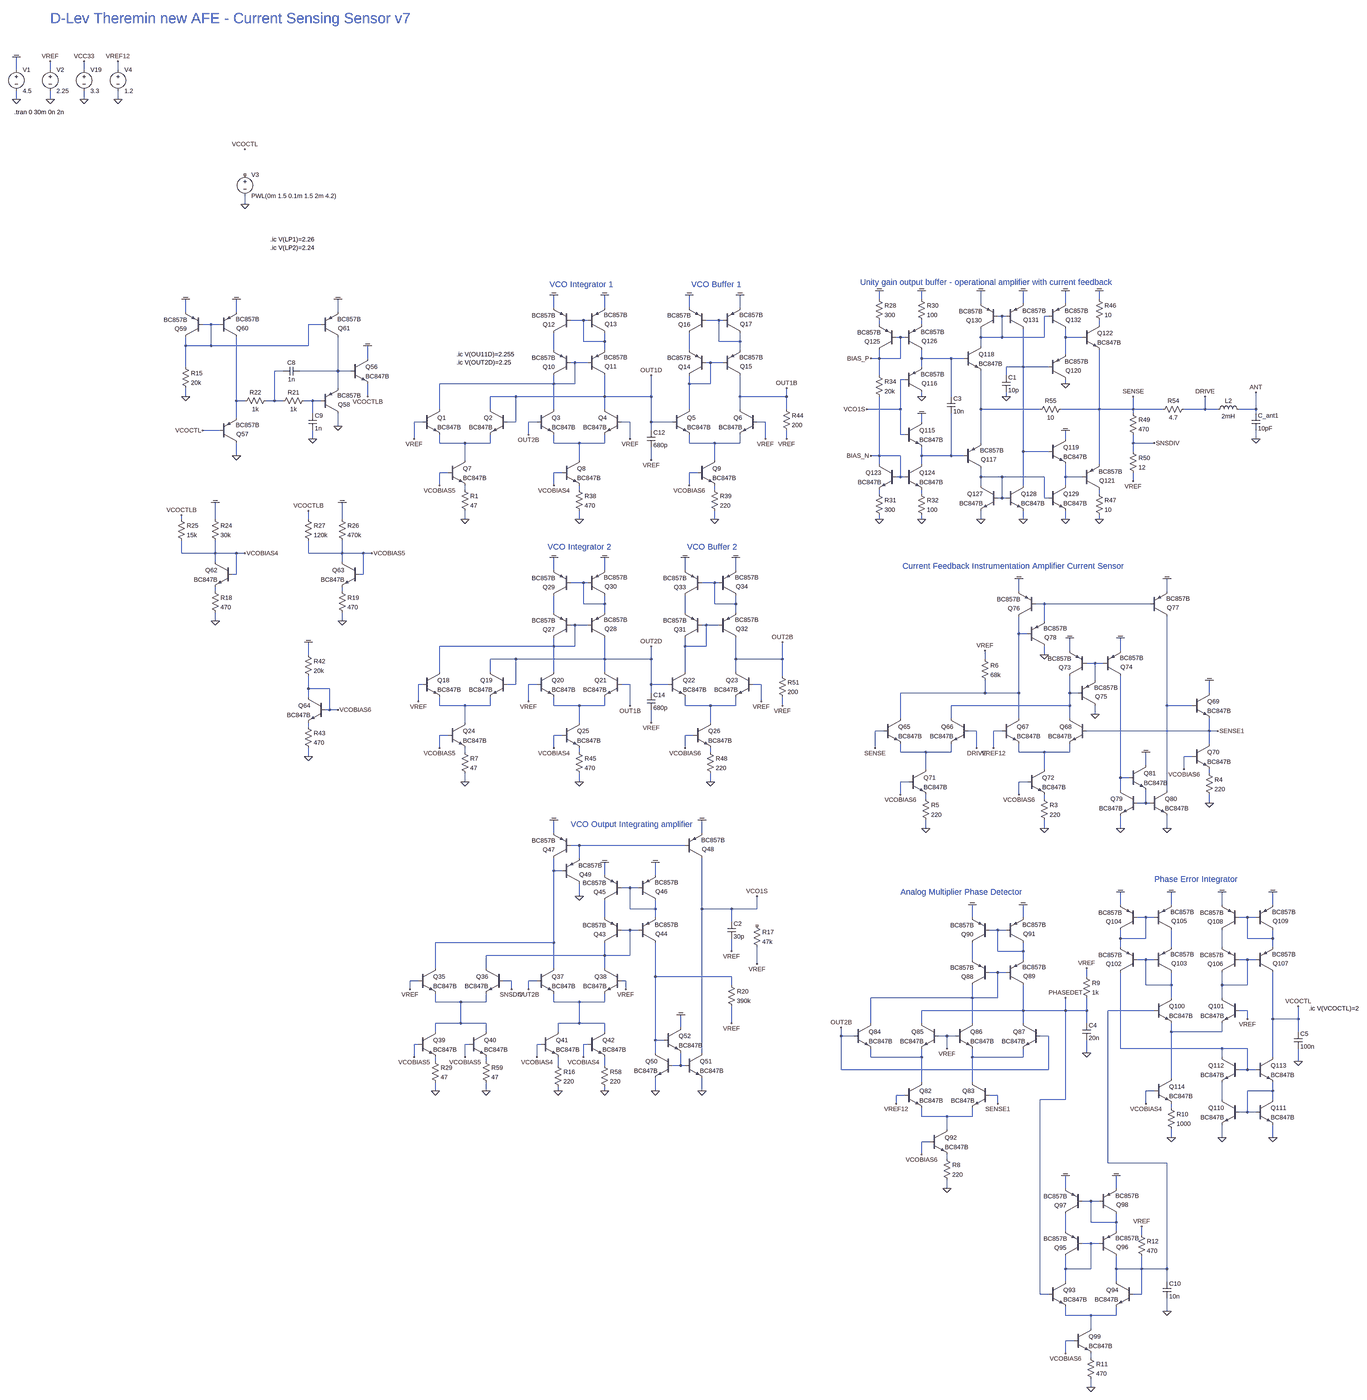
[diagram p0: schematic dlev_frontend_curr_sens_v15.asc, whole sheet]
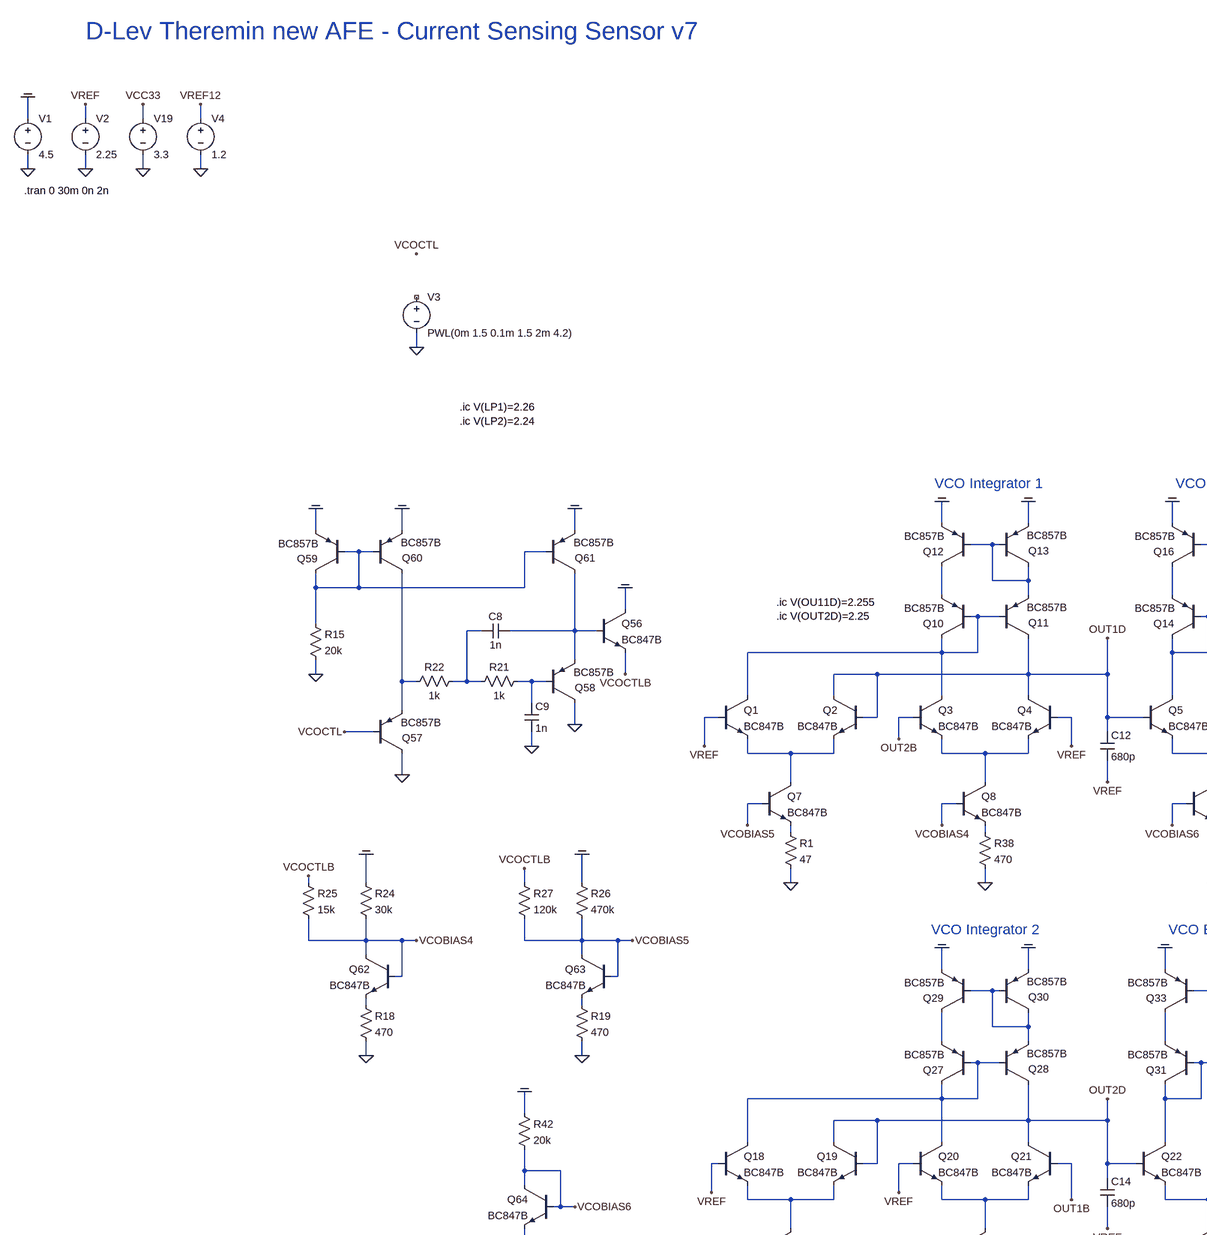
[diagram p1: schematic dlev_frontend_curr_sens_v15.asc, part, row 1 of 2, column 1 of 2]
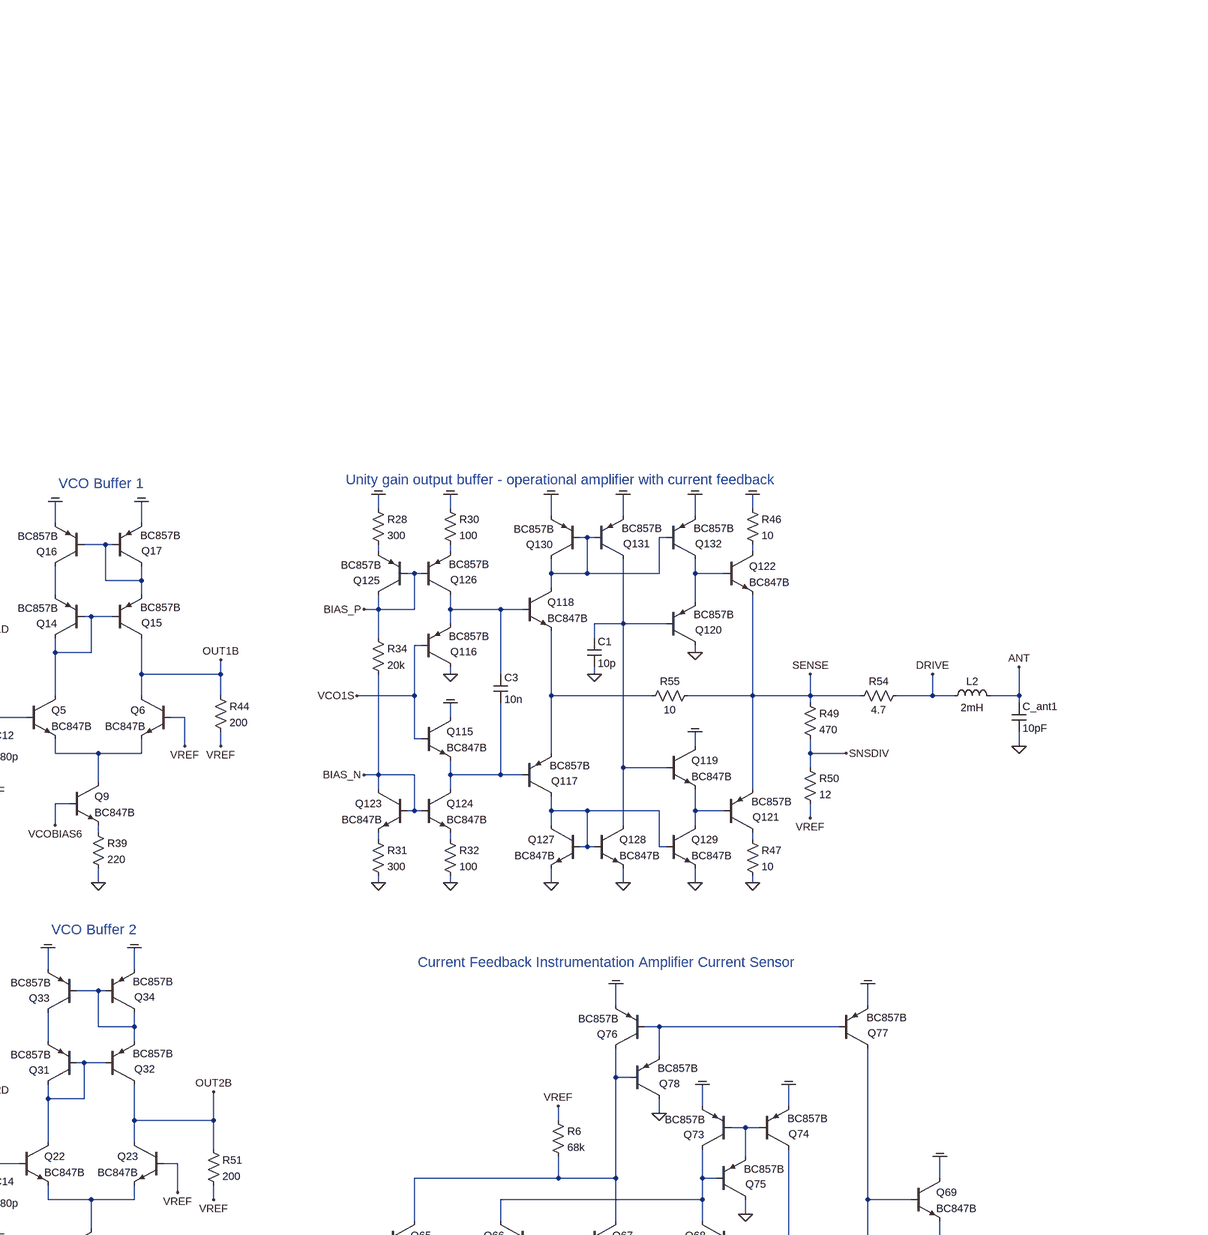
[diagram p2: schematic dlev_frontend_curr_sens_v15.asc, part, row 1 of 2, column 2 of 2]
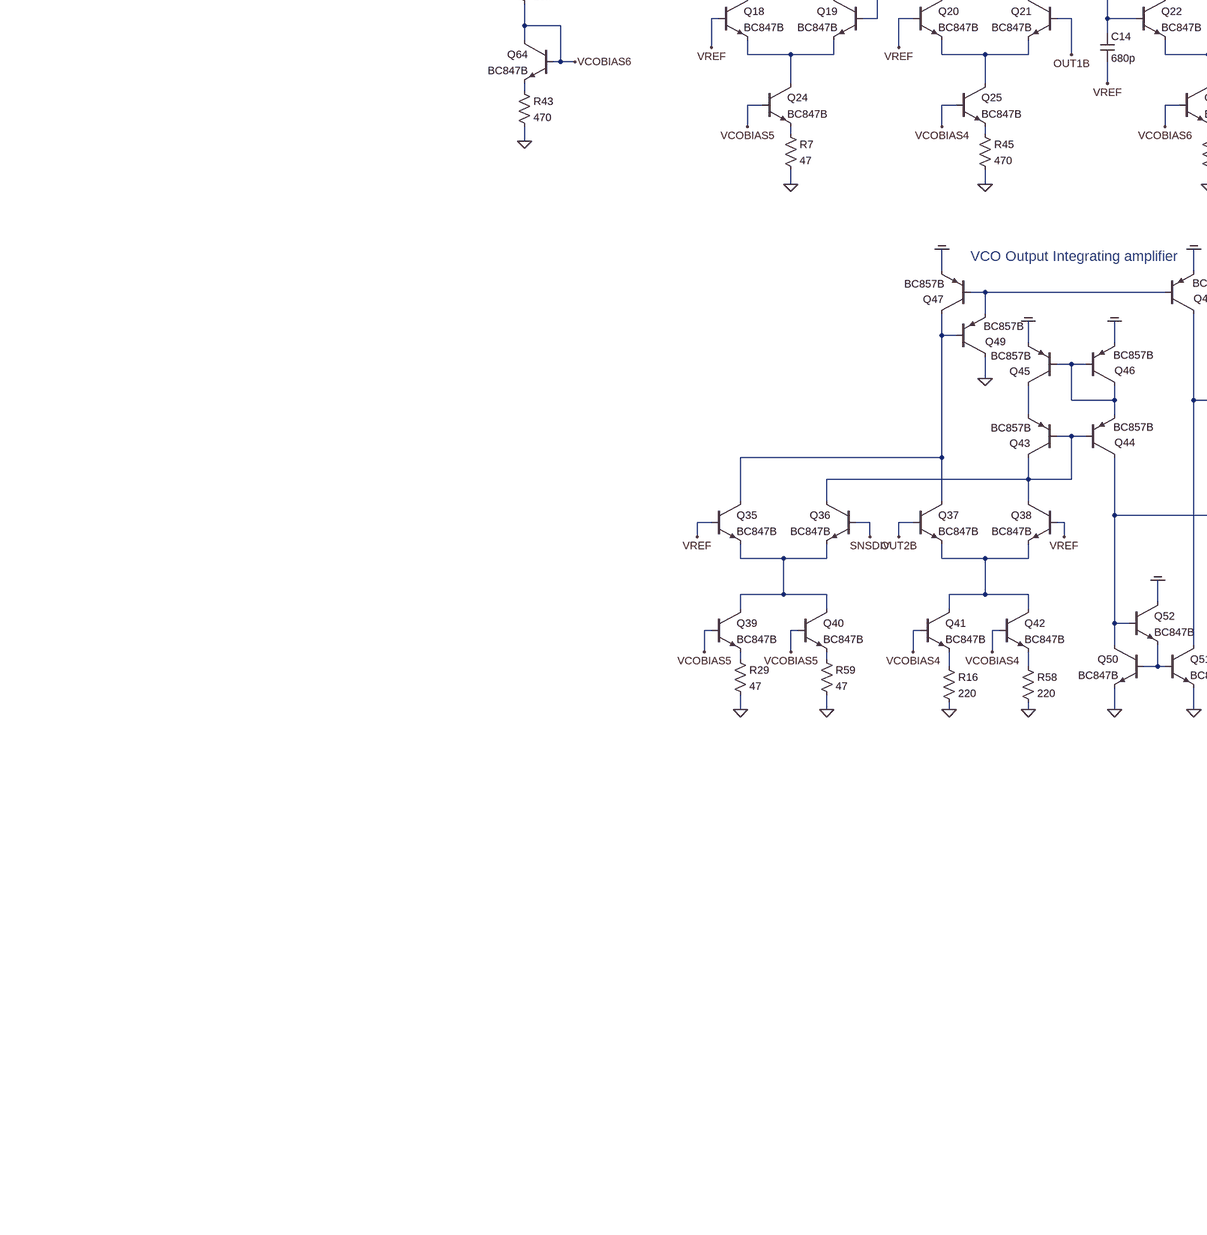
[diagram p3: schematic dlev_frontend_curr_sens_v15.asc, part, row 2 of 2, column 1 of 2]
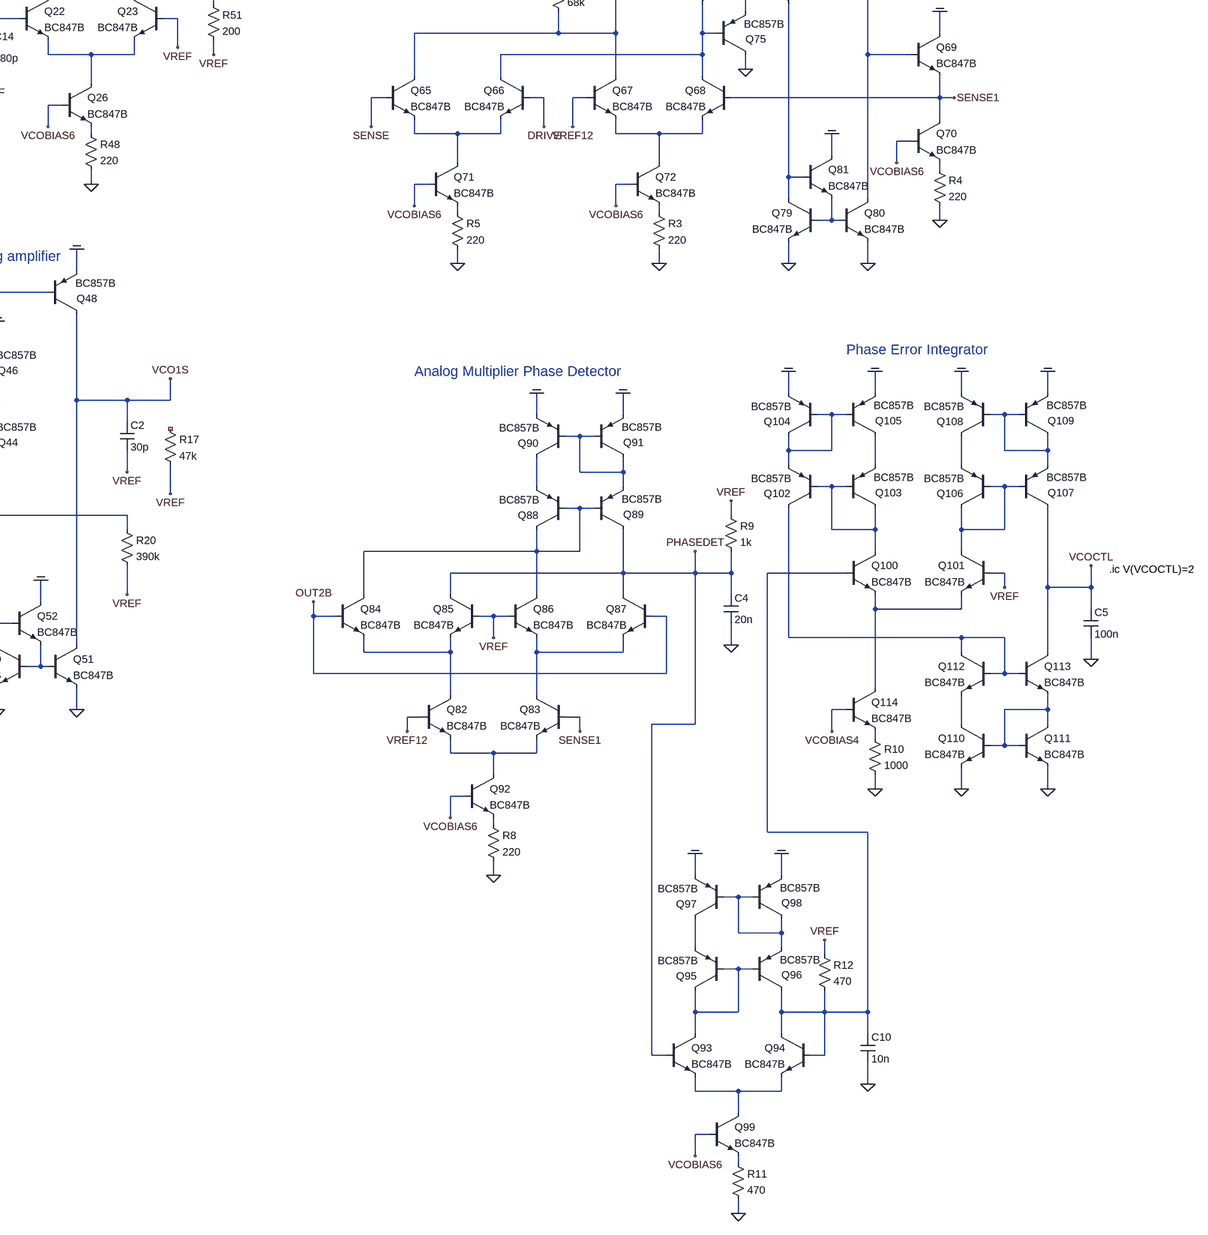
[diagram p4: schematic dlev_frontend_curr_sens_v15.asc, part, row 2 of 2, column 2 of 2]
dlev_frontend_curr_sens_v15.asc, the LTspice schematic file:
Version 4
SHEET 1 13504 15648
WIRE 48 2896 48 2848
WIRE 176 2896 176 2864
WIRE 304 2896 304 2864
WIRE 432 2896 432 2864
WIRE 48 3008 48 2976
WIRE 176 3008 176 2976
WIRE 304 3008 304 2976
WIRE 432 3008 432 2976
WIRE 912 3408 912 3376
WIRE 3312 4816 3312 4784
WIRE 3472 4816 3472 4784
WIRE 4144 4816 4144 4784
WIRE 3696 4832 3696 4784
WIRE 3856 4832 3856 4784
WIRE 4016 4832 4016 4784
WIRE 2080 4848 2080 4800
WIRE 2272 4848 2272 4800
WIRE 2592 4848 2592 4800
WIRE 2784 4848 2784 4800
WIRE 688 4864 688 4816
WIRE 880 4864 880 4816
WIRE 1264 4864 1264 4816
WIRE 3776 4880 3760 4880
WIRE 3792 4880 3776 4880
WIRE 3952 4880 3936 4880
WIRE 2192 4896 2144 4896
WIRE 2208 4896 2192 4896
WIRE 2704 4896 2656 4896
WIRE 2720 4896 2704 4896
WIRE 784 4912 752 4912
WIRE 816 4912 784 4912
WIRE 1200 4912 1152 4912
WIRE 3312 4912 3312 4896
WIRE 3472 4912 3472 4896
WIRE 4144 4912 4144 4896
WIRE 3392 4960 3376 4960
WIRE 3408 4960 3392 4960
WIRE 3696 4960 3696 4928
WIRE 3776 4960 3776 4880
WIRE 3776 4960 3696 4960
WIRE 3936 4960 3936 4880
WIRE 3936 4960 3776 4960
WIRE 4016 4960 4016 4928
WIRE 4080 4960 4016 4960
WIRE 2192 4976 2192 4896
WIRE 2272 4976 2272 4944
WIRE 2272 4976 2192 4976
WIRE 2704 4976 2704 4896
WIRE 2784 4976 2784 4944
WIRE 2784 4976 2704 4976
WIRE 688 4992 688 4960
WIRE 784 4992 784 4912
WIRE 784 4992 688 4992
WIRE 1152 4992 1152 4912
WIRE 1152 4992 784 4992
WIRE 3696 4992 3696 4960
WIRE 2080 5008 2080 4944
WIRE 2272 5008 2272 4976
WIRE 2592 5008 2592 4944
WIRE 2784 5008 2784 4976
WIRE 4016 5024 4016 4960
WIRE 1376 5040 1376 4992
WIRE 3312 5040 3312 5008
WIRE 3312 5040 3280 5040
WIRE 3392 5040 3392 4960
WIRE 3392 5040 3312 5040
WIRE 3472 5040 3472 5008
WIRE 3584 5040 3472 5040
WIRE 3632 5040 3584 5040
WIRE 2160 5056 2144 5056
WIRE 2208 5056 2160 5056
WIRE 2672 5056 2656 5056
WIRE 2720 5056 2672 5056
WIRE 688 5072 688 4992
WIRE 3472 5072 3472 5040
WIRE 3856 5072 3856 4928
WIRE 3856 5072 3792 5072
WIRE 3952 5072 3856 5072
WIRE 1056 5088 1024 5088
WIRE 1264 5088 1264 4960
WIRE 1264 5088 1120 5088
WIRE 1312 5088 1264 5088
WIRE 3312 5104 3312 5040
WIRE 3792 5104 3792 5072
WIRE 3408 5120 3392 5120
WIRE 2080 5136 2080 5104
WIRE 2080 5136 1648 5136
WIRE 2160 5136 2160 5056
WIRE 2160 5136 2080 5136
WIRE 2592 5136 2592 5104
WIRE 2672 5136 2672 5056
WIRE 2672 5136 2592 5136
WIRE 4016 5136 4016 5120
WIRE 1264 5152 1264 5088
WIRE 688 5184 688 5152
WIRE 1376 5184 1376 5136
WIRE 1936 5184 1840 5184
WIRE 2272 5184 2272 5104
WIRE 2272 5184 1936 5184
WIRE 2448 5184 2448 5104
WIRE 2448 5184 2272 5184
WIRE 2784 5184 2784 5104
WIRE 2960 5184 2960 5152
WIRE 2960 5184 2784 5184
WIRE 3472 5184 3472 5168
WIRE 3584 5184 3584 5040
WIRE 3792 5184 3792 5168
WIRE 880 5200 880 4960
WIRE 912 5200 880 5200
WIRE 1024 5200 1024 5088
WIRE 1024 5200 992 5200
WIRE 1056 5200 1024 5200
WIRE 1168 5200 1136 5200
WIRE 1200 5200 1168 5200
WIRE 1648 5232 1648 5136
WIRE 1840 5232 1840 5184
WIRE 2080 5232 2080 5136
WIRE 2272 5232 2272 5184
WIRE 2592 5232 2592 5136
WIRE 2784 5232 2784 5184
WIRE 2960 5232 2960 5184
WIRE 3392 5232 3392 5120
WIRE 3392 5232 3264 5232
WIRE 3696 5232 3696 5088
WIRE 3920 5232 3696 5232
WIRE 4144 5232 4144 5008
WIRE 4144 5232 4000 5232
WIRE 4272 5232 4272 5184
WIRE 4272 5232 4144 5232
WIRE 4384 5232 4272 5232
WIRE 4544 5232 4544 5184
WIRE 4544 5232 4464 5232
WIRE 4592 5232 4544 5232
WIRE 4736 5232 4736 5168
WIRE 4736 5232 4672 5232
WIRE 1168 5248 1168 5200
WIRE 4272 5248 4272 5232
WIRE 4736 5248 4736 5232
WIRE 880 5264 880 5200
WIRE 1584 5280 1552 5280
WIRE 1936 5280 1936 5184
WIRE 1936 5280 1904 5280
WIRE 2016 5280 1984 5280
WIRE 2368 5280 2336 5280
WIRE 2448 5280 2448 5184
WIRE 2528 5280 2448 5280
WIRE 2880 5280 2848 5280
WIRE 3472 5280 3472 5248
WIRE 1264 5296 1264 5248
WIRE 816 5312 752 5312
WIRE 2448 5312 2448 5280
WIRE 1984 5328 1984 5280
WIRE 3392 5328 3392 5232
WIRE 3408 5328 3392 5328
WIRE 1168 5344 1168 5312
WIRE 1552 5344 1552 5280
WIRE 2368 5344 2368 5280
WIRE 2880 5344 2880 5280
WIRE 2960 5344 2960 5312
WIRE 4016 5344 4016 5312
WIRE 4736 5344 4736 5312
WIRE 1648 5360 1648 5328
WIRE 1744 5360 1648 5360
WIRE 1840 5360 1840 5328
WIRE 1840 5360 1744 5360
WIRE 2080 5360 2080 5328
WIRE 2176 5360 2080 5360
WIRE 2272 5360 2272 5328
WIRE 2272 5360 2176 5360
WIRE 2592 5360 2592 5328
WIRE 2688 5360 2592 5360
WIRE 2784 5360 2784 5328
WIRE 2784 5360 2688 5360
WIRE 3696 5360 3696 5232
WIRE 4272 5360 4272 5328
WIRE 4352 5360 4272 5360
WIRE 3856 5392 3856 5072
WIRE 3952 5392 3856 5392
WIRE 4272 5392 4272 5360
WIRE 880 5408 880 5360
WIRE 3312 5408 3312 5184
WIRE 3312 5408 3280 5408
WIRE 3392 5408 3312 5408
WIRE 3472 5408 3472 5376
WIRE 3584 5408 3584 5248
WIRE 3584 5408 3472 5408
WIRE 3632 5408 3584 5408
WIRE 1744 5424 1744 5360
WIRE 2176 5424 2176 5360
WIRE 2448 5424 2448 5376
WIRE 2688 5424 2688 5360
WIRE 3312 5440 3312 5408
WIRE 3472 5440 3472 5408
WIRE 4144 5440 4144 5232
WIRE 1680 5472 1648 5472
WIRE 2112 5472 2080 5472
WIRE 2624 5472 2592 5472
WIRE 3392 5488 3392 5408
WIRE 3392 5488 3376 5488
WIRE 3408 5488 3392 5488
WIRE 3696 5488 3696 5456
WIRE 3776 5488 3696 5488
WIRE 3936 5488 3776 5488
WIRE 4016 5488 4016 5440
WIRE 4080 5488 4016 5488
WIRE 4272 5504 4272 5472
WIRE 1648 5520 1648 5472
WIRE 2080 5520 2080 5472
WIRE 2592 5520 2592 5472
WIRE 3696 5520 3696 5488
WIRE 3856 5520 3856 5392
WIRE 4016 5520 4016 5488
WIRE 1744 5536 1744 5520
WIRE 2176 5536 2176 5520
WIRE 2688 5536 2688 5520
WIRE 3312 5552 3312 5536
WIRE 3472 5552 3472 5536
WIRE 4144 5552 4144 5536
WIRE 3776 5568 3776 5488
WIRE 3776 5568 3760 5568
WIRE 3792 5568 3776 5568
WIRE 3936 5568 3936 5488
WIRE 3952 5568 3936 5568
WIRE 672 5648 672 5632
WIRE 800 5648 800 5584
WIRE 1152 5648 1152 5616
WIRE 1280 5648 1280 5584
WIRE 1744 5648 1744 5616
WIRE 2176 5648 2176 5616
WIRE 2688 5648 2688 5616
WIRE 3312 5648 3312 5632
WIRE 3472 5648 3472 5632
WIRE 3696 5648 3696 5616
WIRE 3856 5648 3856 5616
WIRE 4016 5648 4016 5616
WIRE 4144 5648 4144 5632
WIRE 672 5776 672 5728
WIRE 800 5776 800 5728
WIRE 800 5776 672 5776
WIRE 880 5776 800 5776
WIRE 912 5776 880 5776
WIRE 1152 5776 1152 5728
WIRE 1280 5776 1280 5728
WIRE 1280 5776 1152 5776
WIRE 1360 5776 1280 5776
WIRE 1392 5776 1360 5776
WIRE 800 5808 800 5776
WIRE 1280 5808 1280 5776
WIRE 2080 5840 2080 5792
WIRE 2272 5840 2272 5792
WIRE 2576 5840 2576 5792
WIRE 2768 5840 2768 5792
WIRE 880 5856 880 5776
WIRE 880 5856 864 5856
WIRE 1360 5856 1360 5776
WIRE 1360 5856 1344 5856
WIRE 2192 5888 2144 5888
WIRE 2208 5888 2192 5888
WIRE 2688 5888 2640 5888
WIRE 2704 5888 2688 5888
WIRE 800 5920 800 5904
WIRE 1280 5920 1280 5904
WIRE 3840 5920 3840 5872
WIRE 4400 5920 4400 5872
WIRE 2192 5968 2192 5888
WIRE 2272 5968 2272 5936
WIRE 2272 5968 2192 5968
WIRE 2688 5968 2688 5888
WIRE 2768 5968 2768 5936
WIRE 2768 5968 2688 5968
WIRE 3936 5968 3904 5968
WIRE 4336 5968 3936 5968
WIRE 2080 6000 2080 5936
WIRE 2272 6000 2272 5968
WIRE 2576 6000 2576 5936
WIRE 2768 6000 2768 5968
WIRE 800 6032 800 6000
WIRE 1280 6032 1280 6000
WIRE 3936 6032 3936 5968
WIRE 2160 6048 2144 6048
WIRE 2208 6048 2160 6048
WIRE 2656 6048 2640 6048
WIRE 2704 6048 2656 6048
WIRE 3840 6080 3840 6016
WIRE 3872 6080 3840 6080
WIRE 2080 6128 2080 6096
WIRE 2080 6128 1648 6128
WIRE 2160 6128 2160 6048
WIRE 2160 6128 2080 6128
WIRE 2576 6128 2576 6096
WIRE 2656 6128 2656 6048
WIRE 2656 6128 2576 6128
WIRE 4032 6144 4032 6096
WIRE 4224 6144 4224 6096
WIRE 1152 6160 1152 6112
WIRE 3936 6160 3936 6128
WIRE 1936 6176 1840 6176
WIRE 2272 6176 2272 6096
WIRE 2272 6176 1936 6176
WIRE 2448 6176 2448 6128
WIRE 2448 6176 2272 6176
WIRE 2768 6176 2768 6096
WIRE 2944 6176 2944 6112
WIRE 2944 6176 2768 6176
WIRE 3712 6176 3712 6144
WIRE 4128 6192 4096 6192
WIRE 4160 6192 4128 6192
WIRE 1648 6224 1648 6128
WIRE 1840 6224 1840 6176
WIRE 2080 6224 2080 6128
WIRE 2272 6224 2272 6176
WIRE 2576 6224 2576 6128
WIRE 2768 6224 2768 6176
WIRE 2944 6240 2944 6176
WIRE 4128 6256 4128 6192
WIRE 1584 6272 1568 6272
WIRE 1936 6272 1936 6176
WIRE 1936 6272 1904 6272
WIRE 2016 6272 1984 6272
WIRE 2368 6272 2336 6272
WIRE 2448 6272 2448 6176
WIRE 2512 6272 2448 6272
WIRE 2864 6272 2832 6272
WIRE 1152 6288 1152 6240
WIRE 1232 6288 1152 6288
WIRE 2448 6304 2448 6272
WIRE 3712 6304 3712 6256
WIRE 3712 6304 3392 6304
WIRE 3840 6304 3840 6080
WIRE 3840 6304 3712 6304
WIRE 4032 6304 4032 6240
WIRE 4064 6304 4032 6304
WIRE 4560 6304 4560 6256
WIRE 1152 6320 1152 6288
WIRE 1568 6336 1568 6272
WIRE 1984 6336 1984 6272
WIRE 2864 6336 2864 6272
WIRE 1648 6352 1648 6320
WIRE 1744 6352 1648 6352
WIRE 1840 6352 1840 6320
WIRE 1840 6352 1744 6352
WIRE 2080 6352 2080 6320
WIRE 2176 6352 2080 6352
WIRE 2272 6352 2272 6320
WIRE 2272 6352 2176 6352
WIRE 2368 6352 2368 6272
WIRE 2576 6352 2576 6320
WIRE 2672 6352 2576 6352
WIRE 2768 6352 2768 6320
WIRE 2768 6352 2672 6352
WIRE 2944 6352 2944 6320
WIRE 4032 6352 4032 6304
WIRE 4032 6352 3584 6352
WIRE 4400 6352 4400 6016
WIRE 4496 6352 4400 6352
WIRE 1232 6368 1232 6288
WIRE 1232 6368 1216 6368
WIRE 1264 6368 1232 6368
WIRE 4128 6384 4128 6352
WIRE 3392 6400 3392 6304
WIRE 3584 6400 3584 6352
WIRE 3840 6400 3840 6304
WIRE 4032 6400 4032 6352
WIRE 1744 6416 1744 6352
WIRE 2176 6416 2176 6352
WIRE 2448 6416 2448 6368
WIRE 2672 6416 2672 6352
WIRE 1152 6432 1152 6416
WIRE 3328 6448 3296 6448
WIRE 3680 6448 3648 6448
WIRE 3776 6448 3744 6448
WIRE 4560 6448 4560 6400
WIRE 4560 6448 4096 6448
WIRE 4592 6448 4560 6448
WIRE 1680 6464 1648 6464
WIRE 2112 6464 2080 6464
WIRE 2608 6464 2576 6464
WIRE 4560 6496 4560 6448
WIRE 1648 6512 1648 6464
WIRE 2080 6512 2080 6464
WIRE 2576 6512 2576 6464
WIRE 3296 6512 3296 6448
WIRE 3680 6512 3680 6448
WIRE 3744 6512 3744 6448
WIRE 1744 6528 1744 6512
WIRE 2176 6528 2176 6512
WIRE 2672 6528 2672 6512
WIRE 3392 6528 3392 6496
WIRE 3488 6528 3392 6528
WIRE 3584 6528 3584 6496
WIRE 3584 6528 3488 6528
WIRE 3840 6528 3840 6496
WIRE 3936 6528 3840 6528
WIRE 4032 6528 4032 6496
WIRE 4032 6528 3936 6528
WIRE 1152 6544 1152 6512
WIRE 4496 6544 4464 6544
WIRE 4320 6576 4320 6528
WIRE 3488 6592 3488 6528
WIRE 3936 6592 3936 6528
WIRE 4464 6592 4464 6544
WIRE 4560 6608 4560 6592
WIRE 4224 6624 4224 6240
WIRE 4256 6624 4224 6624
WIRE 1744 6640 1744 6608
WIRE 2176 6640 2176 6608
WIRE 2672 6640 2672 6608
WIRE 3424 6640 3392 6640
WIRE 3872 6640 3840 6640
WIRE 4224 6672 4224 6624
WIRE 4400 6672 4400 6352
WIRE 3392 6688 3392 6640
WIRE 3840 6688 3840 6640
WIRE 3488 6704 3488 6688
WIRE 3936 6704 3936 6688
WIRE 4320 6720 4320 6672
WIRE 4320 6720 4288 6720
WIRE 4336 6720 4320 6720
WIRE 4560 6720 4560 6688
WIRE 3488 6816 3488 6784
WIRE 3936 6816 3936 6784
WIRE 4224 6816 4224 6768
WIRE 4400 6816 4400 6768
WIRE 2080 6832 2080 6784
WIRE 2640 6832 2640 6784
WIRE 2176 6880 2144 6880
WIRE 2576 6880 2176 6880
WIRE 2176 6928 2176 6880
WIRE 2080 6976 2080 6928
WIRE 2112 6976 2080 6976
WIRE 2272 6992 2272 6944
WIRE 2464 6992 2464 6944
WIRE 2368 7040 2336 7040
WIRE 2400 7040 2368 7040
WIRE 2176 7072 2176 7024
WIRE 4224 7104 4224 7056
WIRE 4416 7104 4416 7056
WIRE 4608 7104 4608 7056
WIRE 4800 7104 4800 7056
WIRE 2368 7120 2368 7040
WIRE 2464 7120 2464 7088
WIRE 2464 7120 2368 7120
WIRE 2640 7120 2640 6928
WIRE 2752 7120 2640 7120
WIRE 2848 7120 2848 7072
WIRE 2848 7120 2752 7120
WIRE 2272 7152 2272 7088
WIRE 2464 7152 2464 7120
WIRE 3664 7152 3664 7104
WIRE 3856 7152 3856 7104
WIRE 4320 7152 4288 7152
WIRE 4352 7152 4320 7152
WIRE 4704 7152 4672 7152
WIRE 4736 7152 4704 7152
WIRE 2752 7168 2752 7120
WIRE 2368 7200 2336 7200
WIRE 2400 7200 2368 7200
WIRE 3760 7200 3728 7200
WIRE 3792 7200 3760 7200
WIRE 4224 7232 4224 7200
WIRE 4320 7232 4320 7152
WIRE 4320 7232 4224 7232
WIRE 4704 7232 4704 7152
WIRE 4800 7232 4800 7200
WIRE 4800 7232 4704 7232
WIRE 2080 7248 2080 6976
WIRE 2080 7248 1632 7248
WIRE 4224 7264 4224 7232
WIRE 4416 7264 4416 7200
WIRE 4608 7264 4608 7200
WIRE 4800 7264 4800 7232
WIRE 2752 7280 2752 7232
WIRE 3760 7280 3760 7200
WIRE 3856 7280 3856 7248
WIRE 3856 7280 3760 7280
WIRE 2272 7296 2272 7248
WIRE 2272 7296 1824 7296
WIRE 2368 7296 2368 7200
WIRE 2368 7296 2272 7296
WIRE 3664 7312 3664 7248
WIRE 3856 7312 3856 7280
WIRE 4320 7312 4288 7312
WIRE 4352 7312 4320 7312
WIRE 4704 7312 4672 7312
WIRE 4736 7312 4704 7312
WIRE 2848 7328 2848 7264
WIRE 1632 7344 1632 7248
WIRE 1824 7344 1824 7296
WIRE 2080 7344 2080 7248
WIRE 2272 7344 2272 7296
WIRE 3760 7360 3728 7360
WIRE 3792 7360 3760 7360
WIRE 2464 7376 2464 7248
WIRE 2752 7376 2464 7376
WIRE 4096 7376 4096 7344
WIRE 1568 7392 1536 7392
WIRE 1920 7392 1888 7392
WIRE 2016 7392 1984 7392
WIRE 2352 7392 2336 7392
WIRE 2752 7408 2752 7376
WIRE 4320 7408 4320 7312
WIRE 4416 7408 4416 7360
WIRE 4416 7408 4320 7408
WIRE 4608 7408 4608 7360
WIRE 4704 7408 4704 7312
WIRE 4704 7408 4608 7408
WIRE 1536 7424 1536 7392
WIRE 1920 7424 1920 7392
WIRE 1984 7424 1984 7392
WIRE 2352 7424 2352 7392
WIRE 3664 7456 3664 7408
WIRE 3664 7456 3280 7456
WIRE 3760 7456 3760 7360
WIRE 3760 7456 3664 7456
WIRE 4416 7456 4416 7408
WIRE 4608 7456 4608 7408
WIRE 1632 7472 1632 7440
WIRE 1728 7472 1632 7472
WIRE 1824 7472 1824 7440
WIRE 1824 7472 1728 7472
WIRE 2080 7472 2080 7440
WIRE 2176 7472 2080 7472
WIRE 2272 7472 2272 7440
WIRE 2272 7472 2176 7472
WIRE 3856 7504 3856 7408
WIRE 3856 7504 3472 7504
WIRE 4016 7504 4016 7456
WIRE 4016 7504 3856 7504
WIRE 4096 7504 4096 7456
WIRE 4096 7504 4016 7504
WIRE 4352 7504 4176 7504
WIRE 4704 7504 4672 7504
WIRE 4704 7536 4704 7504
WIRE 4800 7536 4800 7360
WIRE 4896 7536 4896 7488
WIRE 4896 7536 4800 7536
WIRE 1728 7552 1728 7472
WIRE 1728 7552 1632 7552
WIRE 1824 7552 1728 7552
WIRE 2176 7552 2176 7472
WIRE 2176 7552 2096 7552
WIRE 2272 7552 2176 7552
WIRE 2752 7552 2752 7488
WIRE 3280 7552 3280 7456
WIRE 3472 7552 3472 7504
WIRE 3664 7552 3664 7456
WIRE 3856 7552 3856 7504
WIRE 4096 7552 4096 7504
WIRE 2560 7568 2560 7520
WIRE 1632 7584 1632 7552
WIRE 1824 7584 1824 7552
WIRE 2096 7584 2096 7552
WIRE 2272 7584 2272 7552
WIRE 4416 7584 4416 7552
WIRE 4608 7584 4608 7552
WIRE 4608 7584 4416 7584
WIRE 4896 7584 4896 7536
WIRE 3168 7600 3168 7568
WIRE 3216 7600 3168 7600
WIRE 3568 7600 3536 7600
WIRE 3600 7600 3568 7600
WIRE 3952 7600 3920 7600
WIRE 2464 7616 2464 7376
WIRE 2496 7616 2464 7616
WIRE 1568 7632 1552 7632
WIRE 1760 7632 1744 7632
WIRE 2032 7632 2016 7632
WIRE 2208 7632 2192 7632
WIRE 3568 7648 3568 7600
WIRE 4224 7648 4224 7360
WIRE 4608 7648 4224 7648
WIRE 4704 7648 4608 7648
WIRE 2464 7664 2464 7616
WIRE 2640 7664 2640 7120
WIRE 4096 7664 4096 7616
WIRE 1552 7680 1552 7632
WIRE 1744 7680 1744 7632
WIRE 2016 7680 2016 7632
WIRE 2192 7680 2192 7632
WIRE 3280 7680 3280 7648
WIRE 3472 7680 3472 7648
WIRE 3472 7680 3280 7680
WIRE 3664 7680 3664 7648
WIRE 3856 7680 3856 7648
WIRE 3856 7680 3664 7680
WIRE 4608 7680 4608 7648
WIRE 4800 7680 4800 7536
WIRE 1632 7696 1632 7680
WIRE 1824 7696 1824 7680
WIRE 4896 7696 4896 7648
WIRE 2096 7712 2096 7680
WIRE 2272 7712 2272 7680
WIRE 2560 7712 2560 7664
WIRE 2560 7712 2528 7712
WIRE 2576 7712 2560 7712
WIRE 3168 7728 3168 7600
WIRE 3952 7728 3952 7600
WIRE 3952 7728 3168 7728
WIRE 4704 7728 4704 7648
WIRE 4704 7728 4672 7728
WIRE 4736 7728 4704 7728
WIRE 4416 7760 4416 7584
WIRE 3472 7776 3472 7680
WIRE 3664 7776 3664 7680
WIRE 1632 7808 1632 7776
WIRE 1824 7808 1824 7776
WIRE 2096 7808 2096 7792
WIRE 2272 7808 2272 7792
WIRE 2464 7808 2464 7760
WIRE 2640 7808 2640 7760
WIRE 4352 7808 4320 7808
WIRE 4800 7808 4800 7776
WIRE 4800 7808 4704 7808
WIRE 3408 7824 3376 7824
WIRE 3760 7824 3728 7824
WIRE 4016 7840 4016 7504
WIRE 4016 7840 3920 7840
WIRE 4608 7840 4608 7776
WIRE 4800 7840 4800 7808
WIRE 3376 7856 3376 7824
WIRE 3760 7856 3760 7824
WIRE 4320 7856 4320 7808
WIRE 4416 7872 4416 7856
WIRE 4704 7888 4704 7808
WIRE 4704 7888 4672 7888
WIRE 4736 7888 4704 7888
WIRE 3472 7904 3472 7872
WIRE 3568 7904 3472 7904
WIRE 3664 7904 3664 7872
WIRE 3664 7904 3568 7904
WIRE 3568 7952 3568 7904
WIRE 4416 7984 4416 7952
WIRE 4608 7984 4608 7936
WIRE 4800 7984 4800 7936
WIRE 3504 8000 3472 8000
WIRE 3472 8048 3472 8000
WIRE 3568 8064 3568 8048
WIRE 4176 8080 4176 7504
WIRE 4400 8080 4176 8080
WIRE 3568 8176 3568 8144
WIRE 4016 8176 4016 8128
WIRE 4208 8176 4208 8128
WIRE 4112 8224 4080 8224
WIRE 4144 8224 4112 8224
WIRE 4112 8304 4112 8224
WIRE 4208 8304 4208 8272
WIRE 4208 8304 4112 8304
WIRE 4016 8336 4016 8272
WIRE 4208 8336 4208 8304
WIRE 4304 8352 4304 8320
WIRE 4112 8384 4080 8384
WIRE 4144 8384 4112 8384
WIRE 4016 8480 4016 8432
WIRE 4112 8480 4112 8384
WIRE 4112 8480 4016 8480
WIRE 4208 8480 4208 8432
WIRE 4304 8480 4304 8432
WIRE 4304 8480 4208 8480
WIRE 4400 8480 4400 8080
WIRE 4400 8480 4304 8480
WIRE 4016 8528 4016 8480
WIRE 4208 8528 4208 8480
WIRE 4400 8528 4400 8480
WIRE 3920 8576 3920 7840
WIRE 3952 8576 3920 8576
WIRE 4304 8576 4304 8480
WIRE 4304 8576 4272 8576
WIRE 4400 8640 4400 8592
WIRE 4016 8656 4016 8624
WIRE 4112 8656 4016 8656
WIRE 4208 8656 4208 8624
WIRE 4208 8656 4112 8656
WIRE 4112 8704 4112 8656
WIRE 4048 8752 4016 8752
WIRE 4016 8800 4016 8752
WIRE 4112 8816 4112 8800
WIRE 4112 8928 4112 8896
FLAG 48 3008 0
FLAG 48 2848 COM
FLAG 176 3008 0
FLAG 176 2864 VREF
FLAG 304 3008 0
FLAG 304 2864 VCC33
FLAG 912 3200 VCOCTL
FLAG 912 3408 0
FLAG 2176 5648 0
FLAG 2080 5520 VCOBIAS4
FLAG 2368 5344 VREF
FLAG 2448 5424 VREF
FLAG 2688 5648 0
FLAG 1152 6112 COM
FLAG 1152 6544 0
FLAG 2880 5344 VREF
FLAG 2960 5344 VREF
FLAG 2176 6640 0
FLAG 2080 6512 VCOBIAS4
FLAG 1984 6336 VREF
FLAG 2448 6416 VREF
FLAG 2672 6640 0
FLAG 2864 6336 VREF
FLAG 2944 6352 VREF
FLAG 912 5776 VCOBIAS4
FLAG 2448 5104 OUT1D
FLAG 2448 6128 OUT2D
FLAG 2592 4800 COM
FLAG 2784 4800 COM
FLAG 2576 5792 COM
FLAG 2768 5792 COM
FLAG 2960 5152 OUT1B
FLAG 2944 6112 OUT2B
FLAG 2080 4800 COM
FLAG 2272 4800 COM
FLAG 2080 5792 COM
FLAG 2272 5792 COM
FLAG 1744 5648 0
FLAG 1648 5520 VCOBIAS5
FLAG 1552 5344 VREF
FLAG 1744 6640 0
FLAG 1648 6512 VCOBIAS5
FLAG 1568 6336 VREF
FLAG 1392 5776 VCOBIAS5
FLAG 2096 7808 0
FLAG 2016 7680 VCOBIAS4
FLAG 2352 7424 VREF
FLAG 2080 6784 COM
FLAG 2640 6784 COM
FLAG 2272 6944 COM
FLAG 2464 6944 COM
FLAG 2464 7808 0
FLAG 2640 7808 0
FLAG 2752 7280 VREF
FLAG 800 6032 0
FLAG 1280 6032 0
FLAG 2848 7072 VCO1S
FLAG 1984 7424 OUT2B
FLAG 800 5584 COM
FLAG 1280 5584 COM
FLAG 1376 4992 COM
FLAG 1632 7808 0
FLAG 1552 7680 VCOBIAS5
FLAG 1536 7424 VREF
FLAG 2848 7328 VREF
FLAG 3312 5648 0
FLAG 3472 5648 0
FLAG 3472 4784 COM
FLAG 3312 4784 COM
FLAG 3472 5184 0
FLAG 3472 5248 COM
FLAG 3280 5408 BIAS_N
FLAG 3280 5040 BIAS_P
FLAG 3856 4784 COM
FLAG 3696 4784 COM
FLAG 3696 5648 0
FLAG 3856 5648 0
FLAG 3792 5184 0
FLAG 4016 5648 0
FLAG 4016 5312 COM
FLAG 4016 4784 COM
FLAG 4016 5136 0
FLAG 4144 4784 COM
FLAG 4144 5648 0
FLAG 4272 5504 VREF
FLAG 3264 5232 VCO1S
FLAG 4736 5344 0
FLAG 4736 5168 ANT
FLAG 4544 5184 DRIVE
FLAG 4272 5184 SENSE
FLAG 4352 5360 SNSDIV
FLAG 1920 7424 SNSDIV
FLAG 2272 7808 0
FLAG 1824 7808 0
FLAG 2560 7520 COM
FLAG 2176 7072 0
FLAG 2752 7552 VREF
FLAG 2368 6352 OUT1B
FLAG 1984 5328 OUT2B
FLAG 1264 6368 VCOBIAS6
FLAG 2592 5520 VCOBIAS6
FLAG 2576 6512 VCOBIAS6
FLAG 1744 7680 VCOBIAS5
FLAG 2192 7680 VCOBIAS4
FLAG 3936 6816 0
FLAG 3744 6512 VREF12
FLAG 3840 5872 COM
FLAG 4400 5872 COM
FLAG 3840 6688 VCOBIAS6
FLAG 3680 6512 DRIVE
FLAG 3936 6160 0
FLAG 4032 6096 COM
FLAG 4224 6096 COM
FLAG 4128 6384 0
FLAG 4224 6816 0
FLAG 4400 6816 0
FLAG 4320 6528 COM
FLAG 4560 6720 0
FLAG 4464 6592 VCOBIAS6
FLAG 4560 6256 COM
FLAG 3488 6816 0
FLAG 3392 6688 VCOBIAS6
FLAG 3296 6512 SENSE
FLAG 4592 6448 SENSE1
FLAG 3712 6144 VREF
FLAG 432 3008 0
FLAG 432 2864 VREF12
FLAG 3568 8176 0
FLAG 3376 7856 VREF12
FLAG 3472 8048 VCOBIAS6
FLAG 3760 7856 SENSE1
FLAG 3664 7104 COM
FLAG 3856 7104 COM
FLAG 3568 7648 VREF
FLAG 3168 7568 OUT2B
FLAG 4096 7664 0
FLAG 4096 7344 VREF
FLAG 4416 7984 0
FLAG 4608 7056 COM
FLAG 4800 7056 COM
FLAG 4224 7056 COM
FLAG 4416 7056 COM
FLAG 4608 7984 0
FLAG 4800 7984 0
FLAG 4704 7536 VREF
FLAG 4320 7856 VCOBIAS4
FLAG 4896 7488 VCOCTL
FLAG 880 5408 0
FLAG 688 5184 0
FLAG 688 4816 COM
FLAG 880 4816 COM
FLAG 1168 5344 0
FLAG 1264 5296 0
FLAG 1264 4816 COM
FLAG 4896 7696 0
FLAG 4112 8928 0
FLAG 4016 8800 VCOBIAS6
FLAG 4016 8128 COM
FLAG 4208 8128 COM
FLAG 4304 8320 VREF
FLAG 4400 8640 0
FLAG 752 5312 VCOCTL
FLAG 1376 5184 VCOCTLB
FLAG 1152 5616 VCOCTLB
FLAG 672 5632 VCOCTLB
FLAG 4016 7456 PHASEDET
SYMBOL voltage 48 2880 R0
SYMATTR InstName V1
SYMATTR Value 4.5
SYMBOL Voltage 176 2880 R0
SYMATTR InstName V2
SYMATTR Value 2.25
SYMBOL Voltage 304 2880 R0
SYMATTR InstName V19
SYMATTR Value 3.3
SYMBOL Voltage 912 3280 R0
SYMATTR InstName V3
SYMATTR Value PWL(0m 1.5 0.1m 1.5 2m 4.2)
SYMBOL npn 2336 5232 M0
SYMATTR InstName Q4
SYMATTR Value BC847B
SYMBOL npn 2112 5424 R0
SYMATTR InstName Q8
SYMATTR Value BC847B
SYMBOL Res 2160 5520 R0
SYMATTR InstName R38
SYMATTR Value 470
SYMBOL npn 2016 5232 R0
SYMATTR InstName Q3
SYMATTR Value BC847B
SYMBOL Cap 2432 5312 R0
SYMATTR InstName C12
SYMATTR Value 680p
SYMBOL npn 2848 5232 M0
SYMATTR InstName Q6
SYMATTR Value BC847B
SYMBOL npn 2624 5424 R0
SYMATTR InstName Q9
SYMATTR Value BC847B
SYMBOL Res 2672 5520 R0
SYMATTR InstName R39
SYMATTR Value 220
SYMBOL npn 2528 5232 R0
SYMATTR InstName Q5
SYMATTR Value BC847B
SYMBOL npn 1216 6320 M0
SYMATTR InstName Q64
SYMATTR Value BC847B
SYMBOL Res 1136 6144 R0
SYMATTR InstName R42
SYMATTR Value 20k
SYMBOL Res 1136 6416 R0
SYMATTR InstName R43
SYMATTR Value 470
SYMBOL Res 2944 5216 R0
SYMATTR InstName R44
SYMATTR Value 200
SYMBOL npn 2336 6224 M0
SYMATTR InstName Q21
SYMATTR Value BC847B
SYMBOL npn 2112 6416 R0
SYMATTR InstName Q25
SYMATTR Value BC847B
SYMBOL Res 2160 6512 R0
SYMATTR InstName R45
SYMATTR Value 470
SYMBOL npn 2016 6224 R0
SYMATTR InstName Q20
SYMATTR Value BC847B
SYMBOL Cap 2432 6304 R0
SYMATTR InstName C14
SYMATTR Value 680p
SYMBOL npn 2832 6224 M0
SYMATTR InstName Q23
SYMATTR Value BC847B
SYMBOL npn 2608 6416 R0
SYMATTR InstName Q26
SYMATTR Value BC847B
SYMBOL Res 2656 6512 R0
SYMATTR InstName R48
SYMATTR Value 220
SYMBOL npn 2512 6224 R0
SYMATTR InstName Q22
SYMATTR Value BC847B
SYMBOL Res 2928 6224 R0
SYMATTR InstName R51
SYMATTR Value 200
SYMBOL pnp 2656 4944 R180
WINDOW 0 60 32 Left 2
WINDOW 3 58 66 Left 2
SYMATTR InstName Q16
SYMATTR Value BC857B
SYMBOL pnp 2720 4944 M180
WINDOW 0 64 34 Left 2
WINDOW 3 61 68 Left 2
SYMATTR InstName Q17
SYMATTR Value BC857B
SYMBOL pnp 2656 5104 R180
WINDOW 0 60 32 Left 2
WINDOW 3 58 66 Left 2
SYMATTR InstName Q14
SYMATTR Value BC857B
SYMBOL pnp 2720 5104 M180
WINDOW 0 64 34 Left 2
WINDOW 3 61 68 Left 2
SYMATTR InstName Q15
SYMATTR Value BC857B
SYMBOL pnp 2640 5936 R180
WINDOW 0 60 32 Left 2
WINDOW 3 58 66 Left 2
SYMATTR InstName Q33
SYMATTR Value BC857B
SYMBOL pnp 2704 5936 M180
WINDOW 0 64 34 Left 2
WINDOW 3 61 68 Left 2
SYMATTR InstName Q34
SYMATTR Value BC857B
SYMBOL pnp 2640 6096 R180
WINDOW 0 60 32 Left 2
WINDOW 3 58 66 Left 2
SYMATTR InstName Q31
SYMATTR Value BC857B
SYMBOL pnp 2704 6096 M180
WINDOW 0 64 34 Left 2
WINDOW 3 61 68 Left 2
SYMATTR InstName Q32
SYMATTR Value BC857B
SYMBOL pnp 2144 4944 R180
WINDOW 0 60 32 Left 2
WINDOW 3 58 66 Left 2
SYMATTR InstName Q12
SYMATTR Value BC857B
SYMBOL pnp 2208 4944 M180
WINDOW 0 64 34 Left 2
WINDOW 3 61 68 Left 2
SYMATTR InstName Q13
SYMATTR Value BC857B
SYMBOL pnp 2144 5104 R180
WINDOW 0 60 32 Left 2
WINDOW 3 58 66 Left 2
SYMATTR InstName Q10
SYMATTR Value BC857B
SYMBOL pnp 2208 5104 M180
WINDOW 0 64 34 Left 2
WINDOW 3 61 68 Left 2
SYMATTR InstName Q11
SYMATTR Value BC857B
SYMBOL pnp 2144 5936 R180
WINDOW 0 60 32 Left 2
WINDOW 3 58 66 Left 2
SYMATTR InstName Q29
SYMATTR Value BC857B
SYMBOL pnp 2208 5936 M180
WINDOW 0 64 34 Left 2
WINDOW 3 61 68 Left 2
SYMATTR InstName Q30
SYMATTR Value BC857B
SYMBOL pnp 2144 6096 R180
WINDOW 0 60 32 Left 2
WINDOW 3 58 66 Left 2
SYMATTR InstName Q27
SYMATTR Value BC857B
SYMBOL pnp 2208 6096 M180
WINDOW 0 64 34 Left 2
WINDOW 3 61 68 Left 2
SYMATTR InstName Q28
SYMATTR Value BC857B
SYMBOL npn 1904 5232 M0
SYMATTR InstName Q2
SYMATTR Value BC847B
SYMBOL npn 1680 5424 R0
SYMATTR InstName Q7
SYMATTR Value BC847B
SYMBOL Res 1728 5520 R0
SYMATTR InstName R1
SYMATTR Value 47
SYMBOL npn 1584 5232 R0
SYMATTR InstName Q1
SYMATTR Value BC847B
SYMBOL npn 1904 6224 M0
SYMATTR InstName Q19
SYMATTR Value BC847B
SYMBOL npn 1680 6416 R0
SYMATTR InstName Q24
SYMATTR Value BC847B
SYMBOL Res 1728 6512 R0
SYMATTR InstName R7
SYMATTR Value 47
SYMBOL npn 1584 6224 R0
SYMATTR InstName Q18
SYMATTR Value BC847B
SYMBOL npn 2336 7344 M0
SYMATTR InstName Q38
SYMATTR Value BC847B
SYMBOL npn 2032 7584 R0
SYMATTR InstName Q41
SYMATTR Value BC847B
SYMBOL Res 2080 7696 R0
SYMATTR InstName R16
SYMATTR Value 220
SYMBOL npn 2016 7344 R0
SYMATTR InstName Q37
SYMATTR Value BC847B
SYMBOL pnp 2144 6928 R180
WINDOW 0 60 32 Left 2
WINDOW 3 58 66 Left 2
SYMATTR InstName Q47
SYMATTR Value BC857B
SYMBOL pnp 2576 6928 M180
WINDOW 0 64 34 Left 2
WINDOW 3 61 68 Left 2
SYMATTR InstName Q48
SYMATTR Value BC857B
SYMBOL pnp 2336 7088 R180
WINDOW 0 60 32 Left 2
WINDOW 3 58 66 Left 2
SYMATTR InstName Q45
SYMATTR Value BC857B
SYMBOL pnp 2400 7088 M180
WINDOW 0 64 34 Left 2
WINDOW 3 61 68 Left 2
SYMATTR InstName Q46
SYMATTR Value BC857B
SYMBOL npn 2528 7664 M0
SYMATTR InstName Q50
SYMATTR Value BC847B
SYMBOL npn 2576 7664 R0
SYMATTR InstName Q51
SYMATTR Value BC847B
SYMBOL Cap 2736 7168 R0
SYMATTR InstName C2
SYMATTR Value 30p
SYMBOL npn 864 5808 M0
SYMATTR InstName Q62
SYMATTR Value BC847B
SYMBOL Res 784 5904 R0
SYMATTR InstName R18
SYMATTR Value 470
SYMBOL npn 1344 5808 M0
SYMATTR InstName Q63
SYMATTR Value BC847B
SYMBOL Res 1264 5904 R0
SYMATTR InstName R19
SYMATTR Value 470
SYMBOL Res 784 5632 R0
SYMATTR InstName R24
SYMATTR Value 30k
SYMBOL Res 656 5632 R0
SYMATTR InstName R25
SYMATTR Value 15k
SYMBOL Res 1264 5632 R0
SYMATTR InstName R26
SYMATTR Value 470k
SYMBOL Res 1136 5632 R0
SYMATTR InstName R27
SYMATTR Value 120k
SYMBOL npn 1312 5040 R0
SYMATTR InstName Q56
SYMATTR Value BC847B
SYMBOL npn 1888 7344 M0
SYMATTR InstName Q36
SYMATTR Value BC847B
SYMBOL npn 1568 7584 R0
SYMATTR InstName Q39
SYMATTR Value BC847B
SYMBOL Res 1616 7680 R0
SYMATTR InstName R29
SYMATTR Value 47
SYMBOL npn 1568 7344 R0
SYMATTR InstName Q35
SYMATTR Value BC847B
SYMBOL pnp 2336 7248 R180
WINDOW 0 60 32 Left 2
WINDOW 3 58 66 Left 2
SYMATTR InstName Q43
SYMATTR Value BC857B
SYMBOL pnp 2400 7248 M180
WINDOW 0 64 34 Left 2
WINDOW 3 61 68 Left 2
SYMATTR InstName Q44
SYMATTR Value BC857B
SYMBOL Res 2832 7168 R0
SYMATTR InstName R17
SYMATTR Value 47k
SYMBOL pnp 3408 5008 M180
WINDOW 0 64 34 Left 2
WINDOW 3 61 68 Left 2
SYMATTR InstName Q126
SYMATTR Value BC857B
SYMBOL pnp 3376 5008 R180
WINDOW 0 60 32 Left 2
WINDOW 3 58 66 Left 2
SYMATTR InstName Q125
SYMATTR Value BC857B
SYMBOL pnp 3408 5168 M180
WINDOW 0 64 34 Left 2
WINDOW 3 61 68 Left 2
SYMATTR InstName Q116
SYMATTR Value BC857B
SYMBOL npn 3408 5280 R0
SYMATTR InstName Q115
SYMATTR Value BC847B
SYMBOL pnp 3632 5456 M180
WINDOW 0 64 34 Left 2
WINDOW 3 61 68 Left 2
SYMATTR InstName Q117
SYMATTR Value BC857B
SYMBOL npn 3632 4992 R0
SYMATTR InstName Q118
SYMATTR Value BC847B
SYMBOL Res 3296 4800 R0
SYMATTR InstName R28
SYMATTR Value 300
SYMBOL Res 3456 4800 R0
SYMATTR InstName R30
SYMATTR Value 100
SYMBOL Res 3296 5536 R0
SYMATTR InstName R31
SYMATTR Value 300
SYMBOL Res 3456 5536 R0
SYMATTR InstName R32
SYMATTR Value 100
SYMBOL npn 3376 5440 M0
SYMATTR InstName Q123
SYMATTR Value BC847B
SYMBOL npn 3408 5440 R0
SYMATTR InstName Q124
SYMATTR Value BC847B
SYMBOL Res 3296 5088 R0
SYMATTR InstName R34
SYMATTR Value 20k
SYMBOL pnp 3792 4928 M180
WINDOW 0 64 34 Left 2
WINDOW 3 61 68 Left 2
SYMATTR InstName Q131
SYMATTR Value BC857B
SYMBOL pnp 3760 4928 R180
WINDOW 0 60 32 Left 2
WINDOW 3 58 66 Left 2
SYMATTR InstName Q130
SYMATTR Value BC857B
SYMBOL npn 3760 5520 M0
SYMATTR InstName Q127
SYMATTR Value BC847B
SYMBOL npn 3792 5520 R0
SYMATTR InstName Q128
SYMATTR Value BC847B
SYMBOL Cap 3776 5104 R0
SYMATTR InstName C1
SYMATTR Value 10p
SYMBOL npn 3952 5520 R0
SYMATTR InstName Q129
SYMATTR Value BC847B
SYMBOL npn 3952 5344 R0
SYMATTR InstName Q119
SYMATTR Value BC847B
SYMBOL pnp 3952 4928 M180
WINDOW 0 64 34 Left 2
WINDOW 3 61 68 Left 2
SYMATTR InstName Q132
SYMATTR Value BC857B
SYMBOL pnp 3952 5120 M180
WINDOW 0 64 34 Left 2
WINDOW 3 61 68 Left 2
SYMATTR InstName Q120
SYMATTR Value BC857B
SYMBOL npn 4080 4912 R0
SYMATTR InstName Q122
SYMATTR Value BC847B
SYMBOL pnp 4080 5536 M180
WINDOW 0 64 34 Left 2
WINDOW 3 61 68 Left 2
SYMATTR InstName Q121
SYMATTR Value BC857B
SYMBOL Res 4128 4800 R0
SYMATTR InstName R46
SYMATTR Value 10
SYMBOL Res 4128 5536 R0
SYMATTR InstName R47
SYMATTR Value 10
SYMBOL Res 4256 5232 R0
SYMATTR InstName R49
SYMATTR Value 470
SYMBOL Res 4256 5376 R0
SYMATTR InstName R50
SYMATTR Value 12
SYMBOL ind 4576 5248 R270
WINDOW 0 32 56 VTop 2
WINDOW 3 5 56 VBottom 2
SYMATTR InstName L2
SYMATTR Value 2mH
SYMATTR SpiceLine Rser=120 Cpar=1pF
SYMBOL Cap 4720 5248 R0
SYMATTR InstName C_ant1
SYMATTR Value 10pF
SYMBOL Res 4368 5248 R270
WINDOW 0 32 56 VTop 2
WINDOW 3 0 56 VBottom 2
SYMATTR InstName R54
SYMATTR Value 4.7
SYMBOL Res 4016 5216 R90
WINDOW 0 0 56 VBottom 2
WINDOW 3 32 56 VTop 2
SYMATTR InstName R55
SYMATTR Value 10
SYMBOL npn 2208 7584 R0
SYMATTR InstName Q42
SYMATTR Value BC847B
SYMBOL Res 2256 7696 R0
SYMATTR InstName R58
SYMATTR Value 220
SYMBOL npn 1760 7584 R0
SYMATTR InstName Q40
SYMATTR Value BC847B
SYMBOL Res 1808 7680 R0
SYMATTR InstName R59
SYMATTR Value 47
SYMBOL npn 2496 7568 R0
SYMATTR InstName Q52
SYMATTR Value BC847B
SYMBOL pnp 2112 7024 M180
WINDOW 0 64 34 Left 2
WINDOW 3 61 68 Left 2
SYMATTR InstName Q49
SYMATTR Value BC857B
SYMBOL Res 2736 7392 R0
SYMATTR InstName R20
SYMATTR Value 390k
SYMBOL Cap 3568 5184 R0
SYMATTR InstName C3
SYMATTR Value 10n
SYMBOL npn 4096 6400 M0
SYMATTR InstName Q68
SYMATTR Value BC847B
SYMBOL npn 3872 6592 R0
SYMATTR InstName Q72
SYMATTR Value BC847B
SYMBOL Res 3920 6688 R0
SYMATTR InstName R3
SYMATTR Value 220
SYMBOL npn 3776 6400 R0
SYMATTR InstName Q67
SYMATTR Value BC847B
SYMBOL pnp 3904 6016 R180
WINDOW 0 60 32 Left 2
WINDOW 3 58 66 Left 2
SYMATTR InstName Q76
SYMATTR Value BC857B
SYMBOL pnp 4336 6016 M180
WINDOW 0 64 34 Left 2
WINDOW 3 61 68 Left 2
SYMATTR InstName Q77
SYMATTR Value BC857B
SYMBOL npn 3648 6400 M0
SYMATTR InstName Q66
SYMATTR Value BC847B
SYMBOL npn 3328 6400 R0
SYMATTR InstName Q65
SYMATTR Value BC847B
SYMBOL pnp 3872 6128 M180
WINDOW 0 64 34 Left 2
WINDOW 3 61 68 Left 2
SYMATTR InstName Q78
SYMATTR Value BC857B
SYMBOL pnp 4096 6240 R180
WINDOW 0 60 32 Left 2
WINDOW 3 58 66 Left 2
SYMATTR InstName Q73
SYMATTR Value BC857B
SYMBOL pnp 4160 6240 M180
WINDOW 0 64 34 Left 2
WINDOW 3 61 68 Left 2
SYMATTR InstName Q74
SYMATTR Value BC857B
SYMBOL pnp 4064 6352 M180
WINDOW 0 64 34 Left 2
WINDOW 3 61 68 Left 2
SYMATTR InstName Q75
SYMATTR Value BC857B
SYMBOL npn 4288 6672 M0
SYMATTR InstName Q79
SYMATTR Value BC847B
SYMBOL npn 4336 6672 R0
SYMATTR InstName Q80
SYMATTR Value BC847B
SYMBOL npn 4256 6576 R0
SYMATTR InstName Q81
SYMATTR Value BC847B
SYMBOL npn 4496 6496 R0
SYMATTR InstName Q70
SYMATTR Value BC847B
SYMBOL Res 4544 6592 R0
SYMATTR InstName R4
SYMATTR Value 220
SYMBOL npn 4496 6304 R0
SYMATTR InstName Q69
SYMATTR Value BC847B
SYMBOL npn 3424 6592 R0
SYMATTR InstName Q71
SYMATTR Value BC847B
SYMBOL Res 3472 6688 R0
SYMATTR InstName R5
SYMATTR Value 220
SYMBOL Res 3696 6160 R0
SYMATTR InstName R6
SYMATTR Value 68k
SYMBOL Voltage 432 2880 R0
SYMATTR InstName V4
SYMATTR Value 1.2
SYMBOL npn 3728 7776 M0
SYMATTR InstName Q83
SYMATTR Value BC847B
SYMBOL npn 3504 7952 R0
SYMATTR InstName Q92
SYMATTR Value BC847B
SYMBOL Res 3552 8048 R0
SYMATTR InstName R8
SYMATTR Value 220
SYMBOL npn 3408 7776 R0
SYMATTR InstName Q82
SYMATTR Value BC847B
SYMBOL npn 3536 7552 M0
SYMATTR InstName Q85
SYMATTR Value BC847B
SYMBOL npn 3216 7552 R0
SYMATTR InstName Q84
SYMATTR Value BC847B
SYMBOL npn 3920 7552 M0
SYMATTR InstName Q87
SYMATTR Value BC847B
SYMBOL npn 3600 7552 R0
SYMATTR InstName Q86
SYMATTR Value BC847B
SYMBOL pnp 3728 7248 R180
WINDOW 0 60 32 Left 2
WINDOW 3 58 66 Left 2
SYMATTR InstName Q90
SYMATTR Value BC857B
SYMBOL pnp 3792 7248 M180
WINDOW 0 64 34 Left 2
WINDOW 3 61 68 Left 2
SYMATTR InstName Q91
SYMATTR Value BC857B
SYMBOL pnp 3728 7408 R180
WINDOW 0 60 32 Left 2
WINDOW 3 58 66 Left 2
SYMATTR InstName Q88
SYMATTR Value BC857B
SYMBOL pnp 3792 7408 M180
WINDOW 0 64 34 Left 2
WINDOW 3 61 68 Left 2
SYMATTR InstName Q89
SYMATTR Value BC857B
SYMBOL Cap 4080 7552 R0
SYMATTR InstName C4
SYMATTR Value 20n
SYMBOL Res 4080 7360 R0
SYMATTR InstName R9
SYMATTR Value 1k
SYMBOL npn 4672 7456 M0
SYMATTR InstName Q101
SYMATTR Value BC847B
SYMBOL npn 4352 7760 R0
SYMATTR InstName Q114
SYMATTR Value BC847B
SYMBOL Res 4400 7856 R0
SYMATTR InstName R10
SYMATTR Value 1000
SYMBOL npn 4352 7456 R0
SYMATTR InstName Q100
SYMATTR Value BC847B
SYMBOL pnp 4672 7200 R180
WINDOW 0 60 32 Left 2
WINDOW 3 58 66 Left 2
SYMATTR InstName Q108
SYMATTR Value BC857B
SYMBOL pnp 4736 7200 M180
WINDOW 0 64 34 Left 2
WINDOW 3 61 68 Left 2
SYMATTR InstName Q109
SYMATTR Value BC857B
SYMBOL pnp 4672 7360 R180
WINDOW 0 60 32 Left 2
WINDOW 3 58 66 Left 2
SYMATTR InstName Q106
SYMATTR Value BC857B
SYMBOL pnp 4736 7360 M180
WINDOW 0 64 34 Left 2
WINDOW 3 61 68 Left 2
SYMATTR InstName Q107
SYMATTR Value BC857B
SYMBOL pnp 4288 7200 R180
WINDOW 0 60 32 Left 2
WINDOW 3 58 66 Left 2
SYMATTR InstName Q104
SYMATTR Value BC857B
SYMBOL pnp 4352 7200 M180
WINDOW 0 64 34 Left 2
WINDOW 3 61 68 Left 2
SYMATTR InstName Q105
SYMATTR Value BC857B
SYMBOL pnp 4288 7360 R180
WINDOW 0 60 32 Left 2
WINDOW 3 58 66 Left 2
SYMATTR InstName Q102
SYMATTR Value BC857B
SYMBOL pnp 4352 7360 M180
WINDOW 0 64 34 Left 2
WINDOW 3 61 68 Left 2
SYMATTR InstName Q103
SYMATTR Value BC857B
SYMBOL npn 4672 7840 M0
SYMATTR InstName Q110
SYMATTR Value BC847B
SYMBOL npn 4736 7840 R0
SYMATTR InstName Q111
SYMATTR Value BC847B
SYMBOL npn 4672 7680 M0
SYMATTR InstName Q112
SYMATTR Value BC847B
SYMBOL npn 4736 7680 R0
SYMATTR InstName Q113
SYMATTR Value BC847B
SYMBOL Cap 4880 7584 R0
SYMATTR InstName C5
SYMATTR Value 100n
SYMBOL pnp 816 5360 M180
WINDOW 0 64 34 Left 2
WINDOW 3 61 68 Left 2
SYMATTR InstName Q57
SYMATTR Value BC857B
SYMBOL pnp 816 4960 M180
WINDOW 0 64 34 Left 2
WINDOW 3 61 68 Left 2
SYMATTR InstName Q60
SYMATTR Value BC857B
SYMBOL pnp 752 4960 R180
WINDOW 0 60 32 Left 2
WINDOW 3 58 66 Left 2
SYMATTR InstName Q59
SYMATTR Value BC857B
SYMBOL Res 672 5056 R0
SYMATTR InstName R15
SYMATTR Value 20k
SYMBOL Cap 1120 5072 R90
WINDOW 0 0 32 VBottom 2
WINDOW 3 32 32 VTop 2
SYMATTR InstName C8
SYMATTR Value 1n
SYMBOL Res 1152 5184 R90
WINDOW 0 0 56 VBottom 2
WINDOW 3 32 56 VTop 2
SYMATTR InstName R21
SYMATTR Value 1k
SYMBOL Res 1008 5184 R90
WINDOW 0 0 56 VBottom 2
WINDOW 3 32 56 VTop 2
SYMATTR InstName R22
SYMATTR Value 1k
SYMBOL Cap 1152 5248 R0
SYMATTR InstName C9
SYMATTR Value 1n
SYMBOL pnp 1200 5248 M180
WINDOW 0 64 34 Left 2
WINDOW 3 61 68 Left 2
SYMATTR InstName Q58
SYMATTR Value BC857B
SYMBOL pnp 1200 4960 M180
WINDOW 0 64 34 Left 2
WINDOW 3 61 68 Left 2
SYMATTR InstName Q61
SYMATTR Value BC857B
SYMBOL npn 4272 8528 M0
SYMATTR InstName Q94
SYMATTR Value BC847B
SYMBOL npn 4048 8704 R0
SYMATTR InstName Q99
SYMATTR Value BC847B
SYMBOL Res 4096 8800 R0
SYMATTR InstName R11
SYMATTR Value 470
SYMBOL npn 3952 8528 R0
SYMATTR InstName Q93
SYMATTR Value BC847B
SYMBOL pnp 4080 8272 R180
WINDOW 0 60 32 Left 2
WINDOW 3 58 66 Left 2
SYMATTR InstName Q97
SYMATTR Value BC857B
SYMBOL pnp 4144 8272 M180
WINDOW 0 64 34 Left 2
WINDOW 3 61 68 Left 2
SYMATTR InstName Q98
SYMATTR Value BC857B
SYMBOL pnp 4080 8432 R180
WINDOW 0 60 32 Left 2
WINDOW 3 58 66 Left 2
SYMATTR InstName Q95
SYMATTR Value BC857B
SYMBOL pnp 4144 8432 M180
WINDOW 0 64 34 Left 2
WINDOW 3 61 68 Left 2
SYMATTR InstName Q96
SYMATTR Value BC857B
SYMBOL Res 4288 8336 R0
SYMATTR InstName R12
SYMATTR Value 470
SYMBOL Cap 4384 8528 R0
SYMATTR InstName C10
SYMATTR Value 10n
TEXT 40 3056 Left 2 !.tran 0 30m 0n 2n
TEXT 176 2624 Left 5 ;D-Lev Theremin new AFE - Current Sensing Sensor v7
TEXT 1008 3552 Left 2 !.ic V(LP1)=2.26\n.ic V(LP2)=2.24
TEXT 1712 5024 Left 2 !.ic V(OU11D)=2.255\n.ic V(OUT2D)=2.25
TEXT 2600 4760 Left 3 ;VCO Buffer 1
TEXT 2584 5752 Left 3 ;VCO Buffer 2
TEXT 2064 4760 Left 3 ;VCO Integrator 1
TEXT 2056 5752 Left 3 ;VCO Integrator 2
TEXT 2144 6800 Left 3 ;VCO Output Integrating amplifier
TEXT 3240 4752 Left 3 ;Unity gain output buffer - operational amplifier with current feedback
TEXT 3400 5824 Left 3 ;Current Feedback Instrumentation Amplifier Current Sensor
TEXT 3392 7056 Left 3 ;Analog Multiplier Phase Detector
TEXT 4352 7008 Left 3 ;Phase Error Integrator
TEXT 4936 7496 Left 2 !.ic V(VCOCTL)=2

The netlist it stands for:
* dlev_frontend_curr_sens_v15.asc
V1 COM 0 4.5
V2 VREF 0 2.25
V19 VCC33 0 3.3
V3 NC_01 0 PWL(0m 1.5 0.1m 1.5 2m 4.2)
Q4 OUT1D VREF N021 0 BC847B
Q8 N021 VCOBIAS4 N027 0 BC847B
R38 N027 0 470
Q3 N012 OUT2B N021 0 BC847B
C12 OUT1D VREF 680p
Q6 OUT1B VREF N022 0 BC847B
Q9 N022 VCOBIAS6 N028 0 BC847B
R39 N028 0 220
Q5 N013 OUT1D N022 0 BC847B
Q64 VCOBIAS6 VCOBIAS6 N048 0 BC847B
R42 COM VCOBIAS6 20k
R43 N048 0 470
R44 OUT1B VREF 200
Q21 OUT2D OUT1B N045 0 BC847B
Q25 N045 VCOBIAS4 N050 0 BC847B
R45 N050 0 470
Q20 N039 VREF N045 0 BC847B
C14 OUT2D VREF 680p
Q23 OUT2B VREF N046 0 BC847B
Q26 N046 VCOBIAS6 N051 0 BC847B
R48 N051 0 220
Q22 N040 OUT2D N046 0 BC847B
R51 OUT2B VREF 200
Q16 N010 N003 COM 0 BC857B
Q17 N003 N003 COM 0 BC857B
Q14 N013 N013 N010 0 BC857B
Q15 OUT1B N013 N003 0 BC857B
Q33 N038 N033 COM 0 BC857B
Q34 N033 N033 COM 0 BC857B
Q31 N040 N040 N038 0 BC857B
Q32 OUT2B N040 N033 0 BC857B
Q12 N009 N002 COM 0 BC857B
Q13 N002 N002 COM 0 BC857B
Q10 N012 N012 N009 0 BC857B
Q11 OUT1D N012 N002 0 BC857B
Q29 N037 N032 COM 0 BC857B
Q30 N032 N032 COM 0 BC857B
Q27 N039 N039 N037 0 BC857B
Q28 OUT2D N039 N032 0 BC857B
Q2 OUT1D OUT1D N020 0 BC847B
Q7 N020 VCOBIAS5 N026 0 BC847B
R1 N026 0 47
Q1 N012 VREF N020 0 BC847B
Q19 OUT2D OUT2D N044 0 BC847B
Q24 N044 VCOBIAS5 N049 0 BC847B
R7 N049 0 47
Q18 N039 VREF N044 0 BC847B
Q38 N065 VREF N075 0 BC847B
Q41 N075 VCOBIAS4 N083 0 BC847B
R16 N083 0 220
Q37 N060 OUT2B N075 0 BC847B
Q47 N060 N059 COM 0 BC857B
Q48 VCO1S N059 COM 0 BC857B
Q45 N062 N061 COM 0 BC857B
Q46 N061 N061 COM 0 BC857B
Q50 N073 N085 0 0 BC847B
Q51 VCO1S N085 0 0 BC847B
C2 VCO1S VREF 30p
Q62 VCOBIAS4 VCOBIAS4 N034 0 BC847B
R18 N034 0 470
Q63 VCOBIAS5 VCOBIAS5 N035 0 BC847B
R19 N035 0 470
R24 COM VCOBIAS4 30k
R25 VCOCTLB VCOBIAS4 15k
R26 COM VCOBIAS5 470k
R27 VCOCTLB VCOBIAS5 120k
Q56 COM N016 VCOCTLB 0 BC847B
Q36 N065 SNSDIV N074 0 BC847B
Q39 N074 VCOBIAS5 N081 0 BC847B
R29 N081 0 47
Q35 N060 VREF N074 0 BC847B
Q43 N065 N065 N062 0 BC857B
Q44 N073 N065 N061 0 BC857B
R17 NC_02 VREF 47k
Q126 N011 BIAS_P N006 0 BC857B
Q125 BIAS_P BIAS_P N005 0 BC857B
Q116 0 VCO1S N011 0 BC857B
Q115 COM VCO1S N023 0 BC847B
Q117 N024 N023 N019 0 BC857B
Q118 N001 N011 N019 0 BC847B
R28 COM N005 300
R30 COM N006 100
R31 N029 0 300
R32 N030 0 100
Q123 BIAS_N BIAS_N N029 0 BC847B
Q124 N023 BIAS_N N030 0 BC847B
R34 BIAS_P BIAS_N 20k
Q131 N014 N001 COM 0 BC857B
Q130 N001 N001 COM 0 BC857B
Q127 N024 N024 0 0 BC847B
Q128 N014 N024 0 0 BC847B
C1 N014 0 10p
Q129 N025 N024 0 0 BC847B
Q119 COM N014 N025 0 BC847B
Q132 N008 N001 COM 0 BC857B
Q120 0 N014 N008 0 BC857B
Q122 N007 N008 SENSE 0 BC847B
Q121 N031 N025 SENSE 0 BC857B
R46 COM N007 10
R47 N031 0 10
R49 SENSE SNSDIV 470
R50 SNSDIV VREF 12
L2 DRIVE ANT 2mH Rser=120 Cpar=1pF
C_ant1 ANT 0 10pF
R54 SENSE DRIVE 4.7
R55 SENSE N019 10
Q42 N075 VCOBIAS4 N084 0 BC847B
R58 N084 0 220
Q40 N074 VCOBIAS5 N082 0 BC847B
R59 N082 0 47
Q52 COM N073 N085 0 BC847B
Q49 0 N060 N059 0 BC857B
R20 N073 VREF 390k
C3 N011 N023 10n
Q68 N043 SENSE1 N053 0 BC847B
Q72 N053 VCOBIAS6 N057 0 BC847B
R3 N057 0 220
Q67 N041 VREF12 N053 0 BC847B
Q76 N041 N036 COM 0 BC857B
Q77 N047 N036 COM 0 BC857B
Q66 N043 DRIVE N052 0 BC847B
Q65 N041 SENSE N052 0 BC847B
Q78 0 N041 N036 0 BC857B
Q73 N043 N042 COM 0 BC857B
Q74 N055 N042 COM 0 BC857B
Q75 0 N043 N042 0 BC857B
Q79 N055 N058 0 0 BC847B
Q80 N047 N058 0 0 BC847B
Q81 COM N055 N058 0 BC847B
Q70 SENSE1 VCOBIAS6 N054 0 BC847B
R4 N054 0 220
Q69 COM N047 SENSE1 0 BC847B
Q71 N052 VCOBIAS6 N056 0 BC847B
R5 N056 0 220
R6 VREF N041 68k
V4 VREF12 0 1.2
Q83 N080 SENSE1 N089 0 BC847B
Q92 N089 VCOBIAS6 N090 0 BC847B
R8 N090 0 220
Q82 N079 VREF12 N089 0 BC847B
Q85 PHASEDET VREF N079 0 BC847B
Q84 N072 OUT2B N079 0 BC847B
Q87 PHASEDET OUT2B N080 0 BC847B
Q86 N072 VREF N080 0 BC847B
Q90 N069 N066 COM 0 BC857B
Q91 N066 N066 COM 0 BC857B
Q88 N072 N072 N069 0 BC857B
Q89 PHASEDET N072 N066 0 BC857B
C4 PHASEDET 0 20n
R9 VREF PHASEDET 1k
Q101 N071 VREF N077 0 BC847B
Q114 N077 VCOBIAS4 N088 0 BC847B
R10 N088 0 1000
Q100 N070 N076 N077 0 BC847B
Q108 N068 N064 COM 0 BC857B
Q109 N064 N064 COM 0 BC857B
Q106 N071 N071 N068 0 BC857B
Q107 VCOCTL N071 N064 0 BC857B
Q104 N063 N063 COM 0 BC857B
Q105 N067 N063 COM 0 BC857B
Q102 N078 N070 N063 0 BC857B
Q103 N070 N070 N067 0 BC857B
Q110 N087 N086 0 0 BC847B
Q111 N086 N086 0 0 BC847B
Q112 N078 N078 N087 0 BC847B
Q113 VCOCTL N078 N086 0 BC847B
C5 VCOCTL 0 100n
Q57 0 VCOCTL N017 0 BC857B
Q60 N017 N004 COM 0 BC857B
Q59 N004 N004 COM 0 BC857B
R15 N004 0 20k
C8 N016 N015 1n
R21 N018 N015 1k
R22 N015 N017 1k
C9 N018 0 1n
Q58 0 N018 N016 0 BC857B
Q61 N016 N004 COM 0 BC857B
Q94 N076 N076 N094 0 BC847B
Q99 N094 VCOBIAS6 N095 0 BC847B
R11 N095 0 470
Q93 N093 PHASEDET N094 0 BC847B
Q97 N092 N091 COM 0 BC857B
Q98 N091 N091 COM 0 BC857B
Q95 N093 N093 N092 0 BC857B
Q96 N076 N093 N091 0 BC857B
R12 VREF N076 470
C10 N076 0 10n
.model NPN NPN
.model PNP PNP
.lib standard.bjt
.tran 0 30m 0n 2n
* D-Lev Theremin new AFE - Current Sensing Sensor v7
.ic V(LP1)=2.26
.ic V(LP2)=2.24
.ic V(OU11D)=2.255
.ic V(OUT2D)=2.25
* VCO Buffer 1
* VCO Buffer 2
* VCO Integrator 1
* VCO Integrator 2
* VCO Output Integrating amplifier
* Unity gain output buffer - operational amplifier with current feedback
* Current Feedback Instrumentation Amplifier Current Sensor
* Analog Multiplier Phase Detector
* Phase Error Integrator
.ic V(VCOCTL)=2
.backanno
.end